# Altium schematic sheet Temp and Humidity Sensor.SchDoc: Temperature & Humidity Sensor
size A4; Date: Dec. 27th, 2022; Author: Karl Asseily; DrawnBy: Karl Asseily; DocumentNumber: 202301140903; Revision: 1.2; SheetNumber: 20; SheetTotal: 20
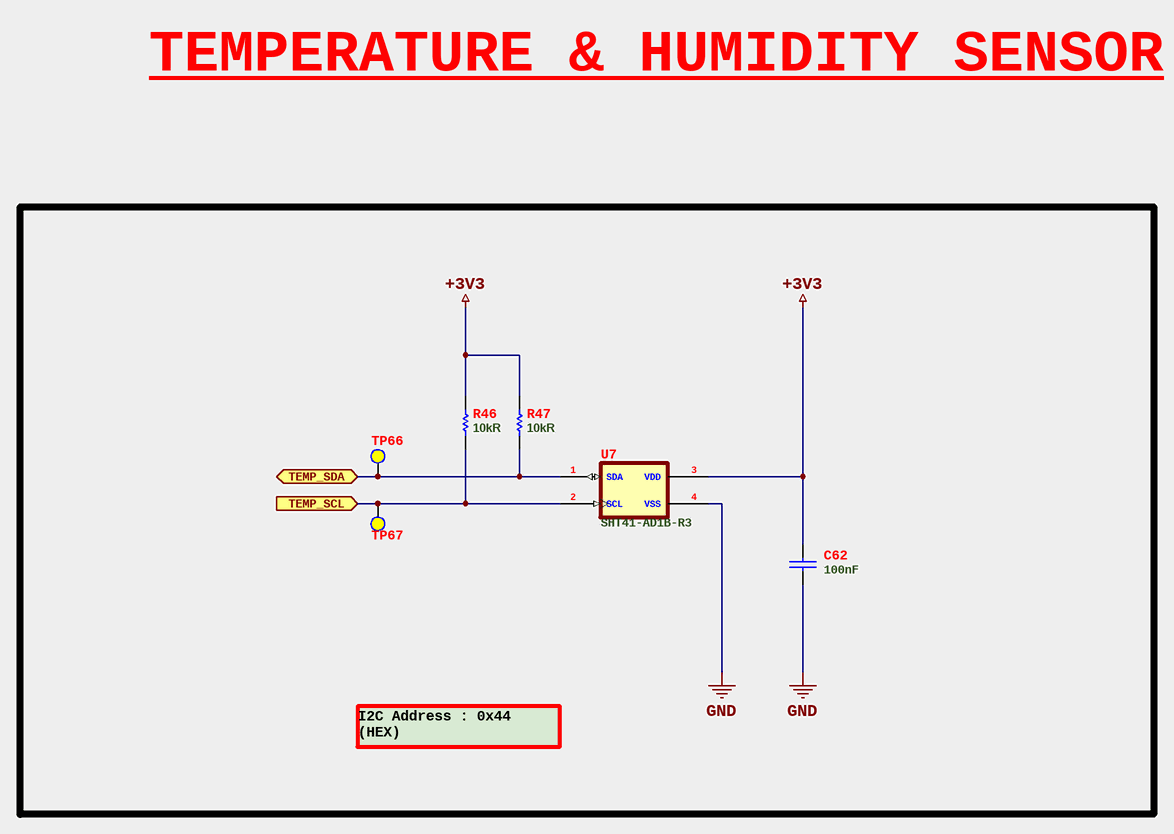
[diagram p0: Temp and Humidity Sensor.SchDoc]

## Parts
C62  100nF  [CAP_0603]
R46  10kR  [RES_0603]
R47  10kR  [RES_0603]
TP66  TEMP_SDA  [TEST POINT HOLE]  (value not drawn)  (no BOM)
TP67  TEMP_SCL  [TEST POINT HOLE]  (value not drawn)  (no BOM)
U7  SHT41-AD1B-R3  [IC_SENSIRION_SHT41-AD1B-R3]

## Ports
TEMP_SCL (in, see Cellar Watchdog, ESP32 Processor, Main Controller Unit), TEMP_SDA (bidir, see Cellar Watchdog, ESP32 Processor, Main Controller Unit)

## Nets
+3V3: C62.1 R46.2 R47.2 U7.3(VDD)
GND: C62.2 U7.4(VSS)
TEMP_SCL: R46.1 TP67.TP U7.2(SCL) ; port TEMP_SCL
TEMP_SDA: R47.1 TP66.TP U7.1(SDA) ; port TEMP_SDA

## Notes on the sheet
- TEMPERATURE & HUMIDITY SENSOR
- I2C Address : 0x44 (HEX)
  0100 0100
- Project
- Sheet
- Size
- Filename
- A4
- of
- Number
- Drawn By
- Rev.
- Variant
- Date

## Library data of the parts
C62 = CAP_0.1uF-50V-10%_0603: 0.1 µF ±10% 50V Ceramic Capacitor X7R 0603 (1608 Metric); Manufacturer: Yageo; Manufacturer Part Number: CC0603KRX7R9BB104; Supplier 1: Digi-Key; RoHS: Yes; Category: Ceramic Capacitors; Stock 1: 10054527; Pricing 1: 1=0.10000, 10=0.05400, 50=0.02960, 100=0.02430, 500=0.01732, 1000=0.01361 (USD); Mounting Technology: Surface Mount; Case/Package: 0603; Pins: 2; Case Code (Metric): 1608; Case Code (Imperial): 0603; Dielectric Material: Ceramic; Min Operating Temperature: -55°C; Max Operating Temperature: 125°C; Package Quantity: 1; Capacitance: 100nF; Voltage Rating: 50V; Tolerance: 10%; Packaging: Tape and Reel; Dielectric: X7R; Termination: SMD/SMT; Voltage: 50V; Series: CC; Length: 0.063inch; Width: 0.031inch; Height: 0.8mm; Thickness: 0.035inch; Depth: 0.8mm; Radiation Hardening: No; Reach SVHC Compliant: Yes; Lead Free: Lead Free; Halogen Free: Halogen Free; RoHS Compliant: Yes; ComponentLink1URL: C:\Users\Public\Documents\Altium\Projects\Cellar_Watchdog\Docs\Capacitor\UPY-GPHC_X7R_6.3V-to-250V_22.pdf; ComponentLink1Description: Datasheet; Supplier Part Number 2: 603-CC603KRX7R9BB104; Supplier Part Number 1: 311-1344-1-ND; Supplier 2: Mouser
R46 R47 = RES_10kR-100mW-1%_0603: 10 kOhms ±1% 0.1W, 1/10W Chip Resistor 0603 (1608 Metric) Moisture Resistant Thick Film; Manufacturer: Yageo; Manufacturer Part Number: RC0603FR-0710KL; Temperature Coefficient: 100ppm/°C; Voltage Rating (DC): 50V; Power Rating: 100mW; Voltage Rating: 75V; Supplier 1: Digi-Key; RoHS: Yes; Category: Chip SMD Resistors; Stock 1: 43209622; Pricing 1: 1=0.10000, 10=0.02100, 100=0.00850, 1000=0.00383, 2500=0.00332 (USD); Case/Package: 0603; Pins: 2; Case Code (Imperial): 0603; Case Code (Metric): 1608; Weight: 7.1E-05oz; Min Operating Temperature: -55°C; Max Operating Temperature: 155°C; Tolerance: 1%; Resistor Type: Thick Film; Resistance: 10kR; Packaging: Tape and Reel; Termination: SMD/SMT; Features: Moisture Resistant; Series: RC; Max Power Dissipation: 100mW; Number of Terminations: 2; Resistance Tolerance: 1%; Construction: Rectangular; Length: 1.6mm; Width: 0.8mm; Height: 0.45mm; Depth: 0.8mm; Lead Pitch: 0.3mm; Reach SVHC Compliant: Yes; Lead Free: Lead Free; Military Standard: Not; RoHS Compliant: Yes; ComponentLink6URL: C:\Users\Public\Documents\Altium\Projects\Cellar_Watchdog\Docs\Resistor\PYu-RC_Group_51_RoHS_L_12.pdf; ComponentLink6Description: Datasheet; Supplier 2: Mouser; Supplier Part Number 1: 311-10.0KHRCT-ND; Supplier Part Number 2: 603-RC0603FR-0710KL
TP66 TP67 = Test Point: PCB Test Point; ClassName: Test Point
  TP66: Value: TEMP_SDA
  TP67: Value: TEMP_SCL
U7 = IC_SHT41-AD1B-R3: Humidity, Temperature 0 ~ 100% RH I²C ±1.8% RH 4 s Surface Mount; Manufacturer: Sensirion; Supplier 1: Digi-Key; Manufacturer Part Number: SHT41-AD1B-R3; RoHS: Yes; Stock 1: 9992; Pricing 1: 1=3.67000, 5=3.24000, 10=2.86200, 25=2.32200, 50=2.05200, 100=1.99800, 500=1.67400, 1000=1.56600, 5000=1.45800 (USD); Supplier Part Number 1: 1649-SHT41-AD1B-R3CT-ND; ComponentLink1Description: Datasheet; ComponentLink1URL: C:\Users\Public\Documents\Altium\Projects\Cellar_Watchdog\Docs\Sensor\Datasheet_SHT4xA.pdf